# EAGLE design brick_serial_ble_MDBT40 (EAGLE 7.2.0)
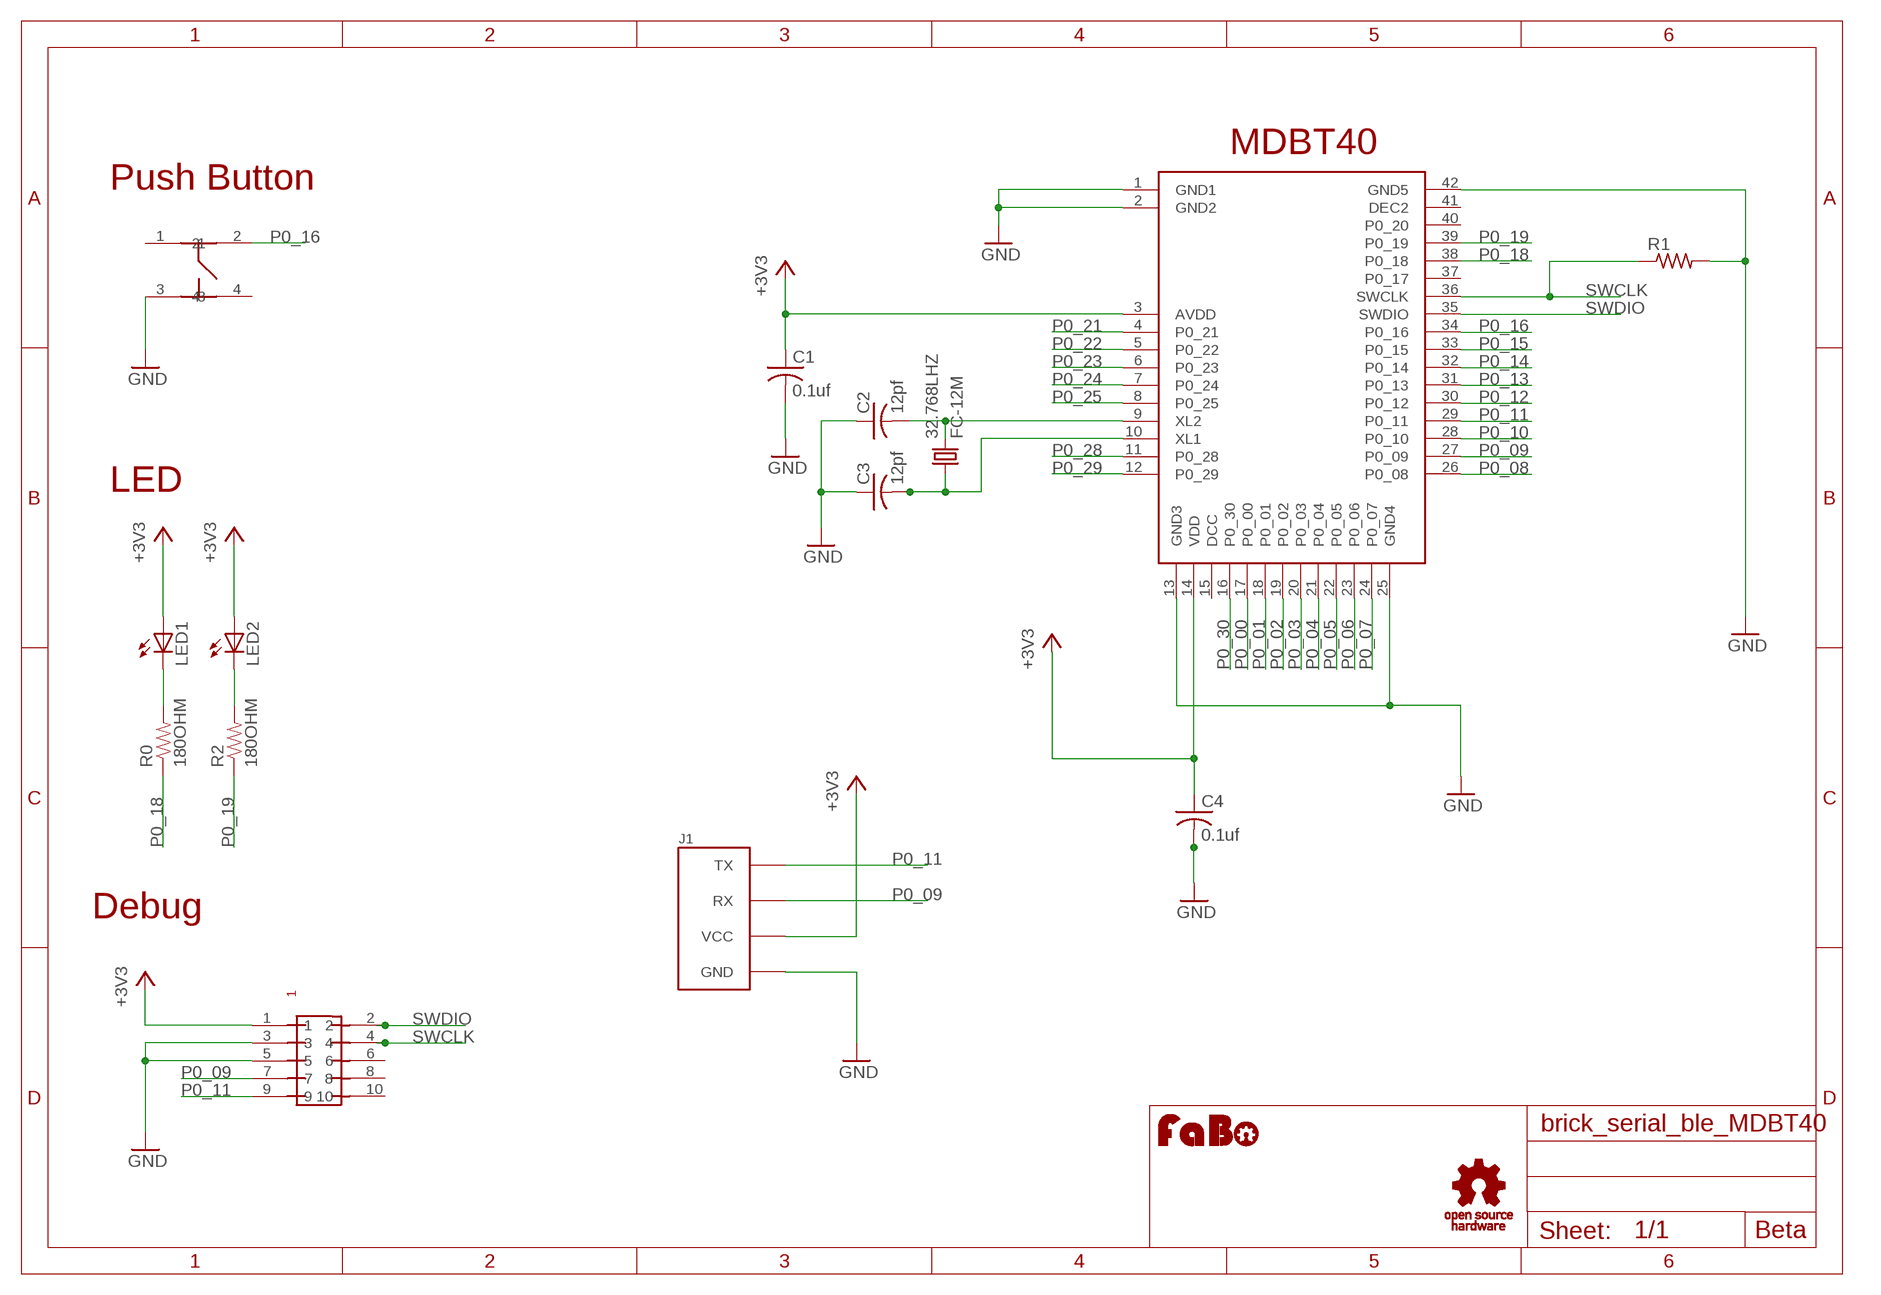
[diagram p0: schematic, sheet 1]

## Parts
32.768LHZ  FC-12M  [FC-12M]
C1  0.1uf  C-USC0603  [C0603]
C2  12pf  C-USC0603  [C0603]
C3  12pf  C-USC0603  [C0603]
C4  0.1uf  C-USC0603  [C0603]
J1  BRICK_SERIAL  [BRICK_SERIAL]
LED1  LEDCHIP-LED0603  [CHIP-LED0603]
LED2  LEDCHIP-LED0603  [CHIP-LED0603]
R0  180OHM  RESISTOR0603-RES  [0603-RES]
R1  R-US_R0603  [R0603]
R2  180OHM  RESISTOR0603-RES  [0603-RES]
U$1  RAYTAC-MDBT40  [RAYTAC-MDBT40]
U$2  PIN-HEADER-SMT(1.27MM)2X5  [PIN-HEADER-SMT(1.27MM)2X5]
U$3  LOGO_FABO-S  [LOGO_FABO_S]
U$4  LOGO_OSHW_T-S  [LOGO_OSHW_T_S]
U$5  SWICTH-4P(KMR2)  [SWITCH-4P(KMR2)]

## Nets
+3V3: C1.1 C4.1 J1.VCC LED1.A LED2.A U$1.3(AVDD) U$1.14(VDD) U$2.1
GND: C1.2 C2.1 C3.1 C4.2 J1.GND R1.2 U$1.1(GND1) U$1.2(GND2) U$1.13(GND3) U$1.25(GND4) U$1.42(GND5) U$2.3 U$2.5 U$5.3
LED1: LED1.C R0.2
N$2: LED2.C R2.2
N$7: 32.768LHZ.2 C2.2 U$1.9(XL2)
N$8: 32.768LHZ.1 C3.2 U$1.10(XL1)
P0_00: U$1.17(P0_00)
P0_01: U$1.18(P0_01)
P0_02: U$1.19(P0_02)
P0_03: U$1.20(P0_03)
P0_04: U$1.21(P0_04)
P0_05: U$1.22(P0_05)
P0_06: U$1.23(P0_06)
P0_07: U$1.24(P0_07)
P0_08: U$1.26(P0_08)
P0_09: J1.RX U$1.27(P0_09) U$2.7
P0_10: U$1.28(P0_10)
P0_11: J1.TX U$1.29(P0_11) U$2.9
P0_12: U$1.30(P0_12)
P0_13: U$1.31(P0_13)
P0_14: U$1.32(P0_14)
P0_15: U$1.33(P0_15)
P0_16: U$1.34(P0_16) U$5.2
P0_18: R0.1 U$1.38(P0_18)
P0_19: R2.1 U$1.39(P0_19)
P0_21: U$1.4(P0_21)
P0_22: U$1.5(P0_22)
P0_23: U$1.6(P0_23)
P0_24: U$1.7(P0_24)
P0_25: U$1.8(P0_25)
P0_28: U$1.11(P0_28)
P0_29: U$1.12(P0_29)
P0_30: U$1.16(P0_30)
SWCLK: R1.1 U$1.36(SWCLK) U$2.4
SWDIO: U$1.35(SWDIO) U$2.2
Unconnected: U$1.15(DCC) U$1.37(P0_17) U$1.40(P0_20) U$1.41(DEC2) U$2.6 U$2.8 U$2.10 U$5.1 U$5.4

## Notes on the sheet
- MDBT40
- Push Button
- LED
- Debug
- Beta

## Library data of the parts
32.768LHZ = crystal:FC-12M: kHz RANGE CRYSTAL UNIT LOW PROFILE SMD Source: Epson Toyocom FC-12M.pdf
C1-C4 = adafruit:C-US: CAPACITOR, American symbol
J1 = gclue:BRICK_SERIAL: FaBo Brick 4pin(SERIAL)
LED1 LED2 = led:LED: LED OSRAM: - CHIPLED LG R971, LG N971, LY N971, LG Q971, LY Q971, LO R971, LY R971 LH N974, LH R974 LS Q976, LO Q976, LY Q976 LO Q996 - Hyper CHIPLED LW Q18S LB Q993, LB Q99A, LB R99A - SideLED LS A670, LO A670, LY A670, LG A670, LP A670 LB A673, LV A673, LT A673, LW A673 LH A674 LY A675 LS A676, LA A676, LO A676, LY A676, LW A676 LS A679, LY A679, LG A679 - Hyper Micro SIDELED® LS Y876, LA Y876, LO Y876, LY Y876 LT Y87S - SmartLED LW L88C, LW L88S LB L89C, LB L89S, LG L890 LS L89K, LO L89K, LY L89K LS L896, LA L896, LO L896, LY L896 - TOPLED LS T670, LO T670, LY T670, LG T670, LP T670 LSG T670, LSP T670, LSY T670, LOP T670, LYG T670 LG T671, LOG T671, LSG T671 LB T673, LV T673, LT T673, LW T673 LH T674 LS T676, LA T676, LO T676, LY T676, LB T676, LH T676, LSB T676, LW T676 LB T67C, LV T67C, LT T67C, LS T67K, LO T67K, LY T67K, LW E67C LS E67B, LA E67B, LO E67B, LY E67B, LB E67C, LV E67C, LT E67C LW T67C LS T679, LY T679, LG T679 LS T770, LO T770, LY T770, LG T770, LP T770 LB T773, LV T773, LT T773, LW T773 LH T774 LS E675, LA E675, LY E675, LS T675 LS T776, LA T776, LO T776, LY T776, LB T776 LHGB T686 LT T68C, LB T68C - Hyper Mini TOPLED® LB M676 - Mini TOPLED Santana® LG M470 LS M47K, LO M47K, LY M47K Source: http://www.osram.convergy.de LUXEON: - LUMILED® LXK2-PW12-R00, LXK2-PW12-S00, LXK2-PW14-U00, LXK2-PW14-V00 LXK2-PM12-R00, LXK2-PM12-S00, LXK2-PM14-U00 LXK2-PE12-Q00, LXK2-PE12-R00, LXK2-PE12-S00, LXK2-PE14-T00, LXK2-PE14-U00 LXK2-PB12-K00, LXK2-PB12-L00, LXK2-PB12-M00, LXK2-PB14-N00, LXK2-PB14-P00, LXK2-PB14-Q00 LXK2-PR12-L00, LXK2-PR12-M00, LXK2-PR14-Q00, LXK2-PR14-R00 LXK2-PD12-Q00, LXK2-PD12-R00, LXK2-PD12-S00 LXK2-PH12-R00, LXK2-PH12-S00 LXK2-PL12-P00, LXK2-PL12-Q00, LXK2-PL12-R00 Source: www.luxeon.com KINGBRIGHT: KA-3528ASYC Source: www.kingbright.com
R0 R2 = SparkFun:RESISTOR: Resistor Basic schematic elements and footprints for 0603, 1206, and PTH resistors.
R1 = adafruit:R-US_: RESISTOR, American symbol
U$1 = gclueBT:RAYTAC-MDBT40
U$2 = gclue:PIN-HEADER-SMT(1.27MM)2X5: PIN-HEADER-SMT (1.27MM) 2x5
U$3 = FaBo:LOGO_FABO
U$4 = gclue:LOGO_OSHW_T
U$5 = gclue-test:SWICTH-4P(KMR2)

## Net classes
0 default: width 0.203 mm

## Board
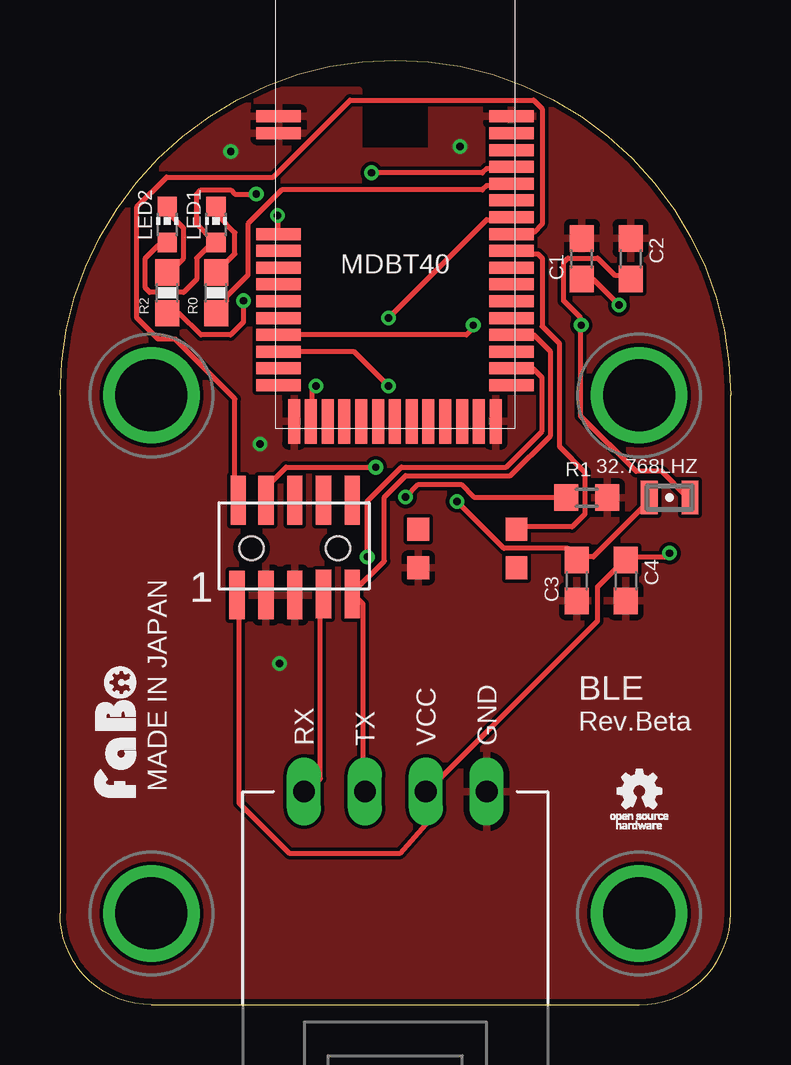
[diagram p1: board, top side]
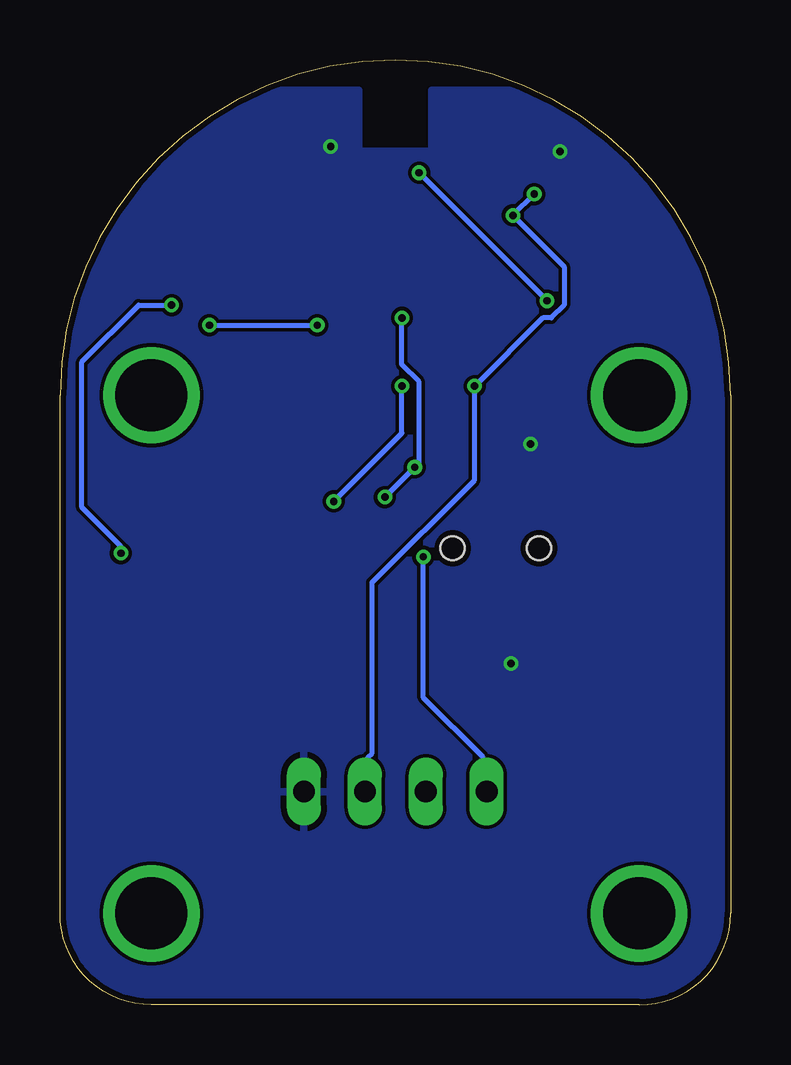
[diagram p2: board, bottom side, seen from below]

Size 27.94 x 39.37 mm. Coordinates in mm from the lower left corner, seen from the top.
Copper layers (1*16): Top 0.035mm / dielectric 1.5mm / Bottom 0.035mm
Design rules "Elecrow_2-layer_eagle_rule": minimum track width 6mil, minimum drill 12mil, track to track 6mil, track to pad 6mil, pad to pad 6mil, via to via 6mil, smd to smd 0mil, copper to edge 10mil, drill to drill 10mil, minimum pad ring 10mil, minimum via ring 6mil, stop-mask expansion 2mil, vias tented up to drill 100mil, thermal gap 10mil

### Footprints (pad centres in the part's own frame; a part is rotated, then mirrored left to right if it is on the bottom)
FC-12M = smd 0.7 x 1.4: 1 -0.85,0; 2 0.85,0
C0603 = smd 1.1 x 1: 1 -0.85,0; 2 0.85,0
BRICK_SERIAL = drill 0.9 long: GND 3.81,-10.16; RX -3.81,-10.16; TX -1.27,-10.16; VCC 1.27,-10.16 | drill 3 pad 3.81: P$5 -10.16,6.35; P$6 10.16,6.35; P$7 -10.16,-15.24; P$8 10.16,-15.24
CHIP-LED0603 = smd 0.8 x 0.8: A 0,-0.75; C 0,0.75
0603-RES = smd 1.1 x 1: 1 -0.85,0; 2 0.85,0
R0603 = smd 1 x 1.1: 1 -0.85,0; 2 0.85,0
RAYTAC-MDBT40 = smd 1.85 x 0.5: 1 -4.86,4; 2 -4.86,3.3; 3 -4.86,-0.9; 4 -4.86,-1.6; 5 -4.86,-2.3; 6 -4.86,-3; 7 -4.86,-3.7; 8 -4.86,-4.4; 9 -4.86,-5.1; 10 -4.86,-5.8; 11 -4.86,-6.5; 12 -4.86,-7.2; 26 4.84,-7.2; 27 4.84,-6.5; 28 4.84,-5.8; 29 4.84,-5.1; 30 4.84,-4.4; 31 4.84,-3.7; 32 4.84,-3; 33 4.84,-2.3; 34 4.84,-1.6; 35 4.84,-0.9; 36 4.84,-0.2; 37 4.84,0.5; 38 4.84,1.2; 39 4.84,1.9; 40 4.84,2.6; 41 4.84,3.3; 42 4.84,4 | smd 0.5 x 1.85: 13 -4.22,-8.71; 14 -3.52,-8.71; 15 -2.82,-8.71; 16 -2.12,-8.71; 17 -1.42,-8.71; 18 -0.72,-8.71; 19 -0.02,-8.71; 20 0.68,-8.71; 21 1.38,-8.71; 22 2.08,-8.71; 23 2.78,-8.71; 24 3.48,-8.71; 25 4.18,-8.71
PIN-HEADER-SMT(1.27MM)2X5 = smd 0.635 x 2.032: 1 -2.4,-1.95; 2 -2.35,2; 3 -1.2,-1.95; 4 -1.2,2; 5 0,-1.95; 6 0,2; 7 1.2,-1.9; 8 1.2,2; 9 2.4,-1.9; 10 2.4,2 | hole 1: 1.8,0; -1.8,0
SWITCH-4P(KMR2) = smd 0.9 x 0.95: 1 -1,0; 2 3.1,0; 3 -1,-1.6; 4 3.1,-1.6

### Placement (x,y rotation side)
32.768LHZ  25.4,21.13 0 top
C1  21.74,31.09 90 top
C2  23.77,31.09 270 top
C3  21.54,17.68 90 top
C4  23.57,17.68 270 top
J1  13.97,19.05 0 top
LED1  6.5,32.51 0 top
LED2  4.47,32.51 0 top
R0  6.5,29.67 90 top
R1  21.95,21.13 0 top
R2  4.47,29.67 90 top
U$1  13.97,33.02 0 top
U$2  9.78,19.02 0 top
U$3  3.17,11.43 90 top
U$4  24.13,8.89 0 top
U$5  15.93,19.81 0 top

### Tracks (layer width: path | path; a pad name or v marks a point on that pad's centre or on a via)
+3V3  (via drill 0.3)
  Top 0.203: 6.4,31.83 5.69,31.11 5.69,30.23 5.16,29.69 3.73,29.69 3.56,29.87 3.56,31.11 4.09,31.65 4.45,31.65 LED2.A | v9.07,32.89 9.07,32.18 U$1.3 | v8.18,33.78 7.29,33.78 7.11,33.96 5.87,33.96 5.69,33.78 5.69,32.54 6.4,31.83 | 6.4,31.83 LED1.A | v10.67,25.78 10.49,25.6 10.49,24.36 U$1.14 | v23.29,29.16 22.23,30.23 21.87,30.23 C1.1 | v25.4,18.82 25.25,18.67 23.65,18.67 C4.1 23.47,18.49 22.4,17.42 22.4,16 15.29,8.89 J1.VCC 15.24,7.52 14.15,6.3 9.58,6.3 7.47,8.41 7.47,17.07 U$2.1
  Bottom 0.203: v8.18,33.78 v9.07,32.89 6.93,30.76 6.93,29.16 7.47,28.63 7.82,28.63 v10.67,25.78 10.67,21.87 14.94,17.6 14.94,10.49 15.11,10.31 15.11,8.89 J1.VCC | v23.29,29.16 24.66,29.16 27.03,26.8 27.03,20.73 25.4,19.1 v25.4,18.82
GND  (via drill 0.3)
  other vias: 9.14,14.22 8.33,23.37 7.11,35.56 16.66,35.76
  pour Bottom: 8.64,40.64 8.64,38.1 12.45,38.1 12.45,35.56 15.49,35.56 15.49,38.1 19.3,38.1 19.3,40.64 29.21,40.64 29.21,24.89 29.21,0 29.21,-1.27 -1.27,-1.27 -1.52,-1.27 -1.52,37.59 -1.52,40.64
  pour Top: 8.64,40.64 8.64,38.1 12.45,38.1 12.45,35.56 15.49,35.56 15.49,38.1 19.3,38.1 19.3,40.64 29.21,40.64 29.21,24.89 29.21,0 29.21,-1.27 -1.27,-1.27 -1.52,-1.27 -1.52,37.59 -1.52,40.64
LED1
  Top 0.203: LED1.C 6.58,33.25 6.58,32.89 7.29,32.18 7.29,31.29 6.58,30.58 R0.2
N$2
  Top 0.203: LED2.C 4.62,33.25 4.62,32.89 5.16,32.36 5.16,31.11 4.62,30.58 R2.2
N$7  (via drill 0.3)
  Top 0.203: 21.69,28.32 21.69,24.54 24,22.23 25.07,22.23 26.14,21.16 32.768LHZ.2 | 21.69,28.32 21.69,28.63 20.98,29.34 20.98,30.94 21.16,31.11 22.4,31.11 23.11,30.4 23.65,30.4 C2.2 | v17.22,28.32 17.27,28.25 16.94,27.91 9.25,27.91 U$1.9 | 21.69,28.32 v21.72,28.32
  Bottom 0.203: v21.72,28.32 v17.22,28.32
N$8  (via drill 0.3)
  Top 0.203: 32.768LHZ.1 24.54,20.98 22.23,18.67 21.69,18.67 C3.2 21.51,18.67 21.16,19.02 18.49,19.02 v16.54,20.98 | v13.69,25.78 12.27,27.2 9.25,27.2 U$1.10
  Bottom 0.203: v13.69,25.78 13.69,23.82 v16.54,20.98
P0_09  (via drill 0.3)
  Top 0.203: v12.8,18.67 12.8,20.98 14.22,22.4 18.59,22.4 20.09,23.9 20.09,26.14 19.74,26.49 18.85,26.49 U$1.27 | U$2.7 10.85,17.07 10.85,9.42 10.31,8.89 J1.RX
  Bottom 0.203: v12.8,18.67 12.8,12.8 10.31,10.31 10.31,8.89 J1.RX
P0_11
  Top 0.203: U$1.29 18.85,27.91 19.74,27.91 20.45,27.2 20.45,23.72 18.77,22.05 14.4,22.05 13.51,21.16 13.51,18.49 12.27,17.25 U$2.9 12.27,17.07 12.62,16.71 12.62,8.89 J1.TX
P0_16
  Top 0.203: U$5.2 19.2,19.91 21.34,19.91 21.87,20.45 21.87,22.2 20.8,23.27 20.8,27.56 20.09,28.27 20.09,31.11 19.91,31.29 18.85,31.29 U$1.34
P0_18
  Top 0.203: R0.1 6.58,28.98 6.93,29.34 6.93,29.52 7.82,30.4 7.82,32.54 9.25,33.96 17.6,33.96 17.78,34.14 18.67,34.14 U$1.38
P0_19  (via drill 0.3)
  Top 0.203: v7.64,29.34 7.64,28.45 7.11,27.91 5.87,27.91 4.98,28.8 4.62,28.8 R2.1 | v12.98,34.67 17.6,34.67 17.78,34.85 18.67,34.85 U$1.39
  Bottom 0.203: v12.98,34.67 v7.64,29.34
SWCLK  (via drill 0.3)
  Top 0.203: v14.4,21.16 14.94,21.69 16.71,21.69 17.25,21.16 20.98,21.16 R1.1 | v13.16,22.4 9.42,22.4 8.71,21.69 8.71,21.16 U$2.4 | v13.69,28.63 17.78,32.72 18.67,32.72 U$1.36
  Bottom 0.203: v14.4,21.16 v13.16,22.4 12.98,22.58 12.98,25.96 13.69,26.67 v13.69,28.63
SWDIO
  Top 0.203: U$1.35 18.85,32.18 19.74,32.18 20.09,32.54 20.09,37.34 19.74,37.69 12.09,37.69 8.89,34.49 4.45,34.49 3.2,33.25 3.2,28.63 4.09,27.74 4.8,27.74 7.29,25.25 7.29,21.16 U$2.2

### Text on the board
tPlace: MDBT40 | BLE | Rev.Beta | MADE IN JAPAN